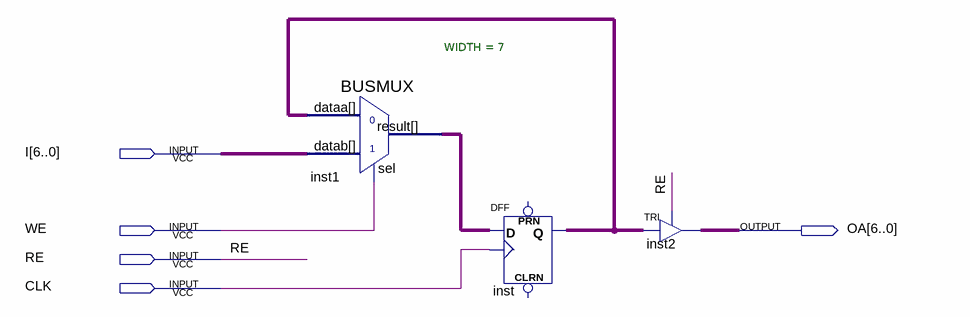
[diagram p0: schematic sheet]
// Quartus schematic Register1x8.bdf as structural Verilog: 3 symbols, 5 pins
module Register1x8 (
  input  [6:0] I,
  input  WE,
  input  RE,
  input  CLK,
  output [6:0] OA
);

  wire [6:0] inst1_result, inst_q;

  BUSMUX #(.WIDTH(7)) inst1 (.datab(I), .sel(WE), .dataa(inst_q), .result(inst1_result));
  DFF inst[6:0] (.CLK(CLK), .D(inst1_result), .Q(inst_q));  // open: CLRN, PRN
  TRI inst2[6:0] (.IN(inst_q), .OE(RE), .OUT(OA));
endmodule
